# Altium project Peggy Receiver.PrjPcb
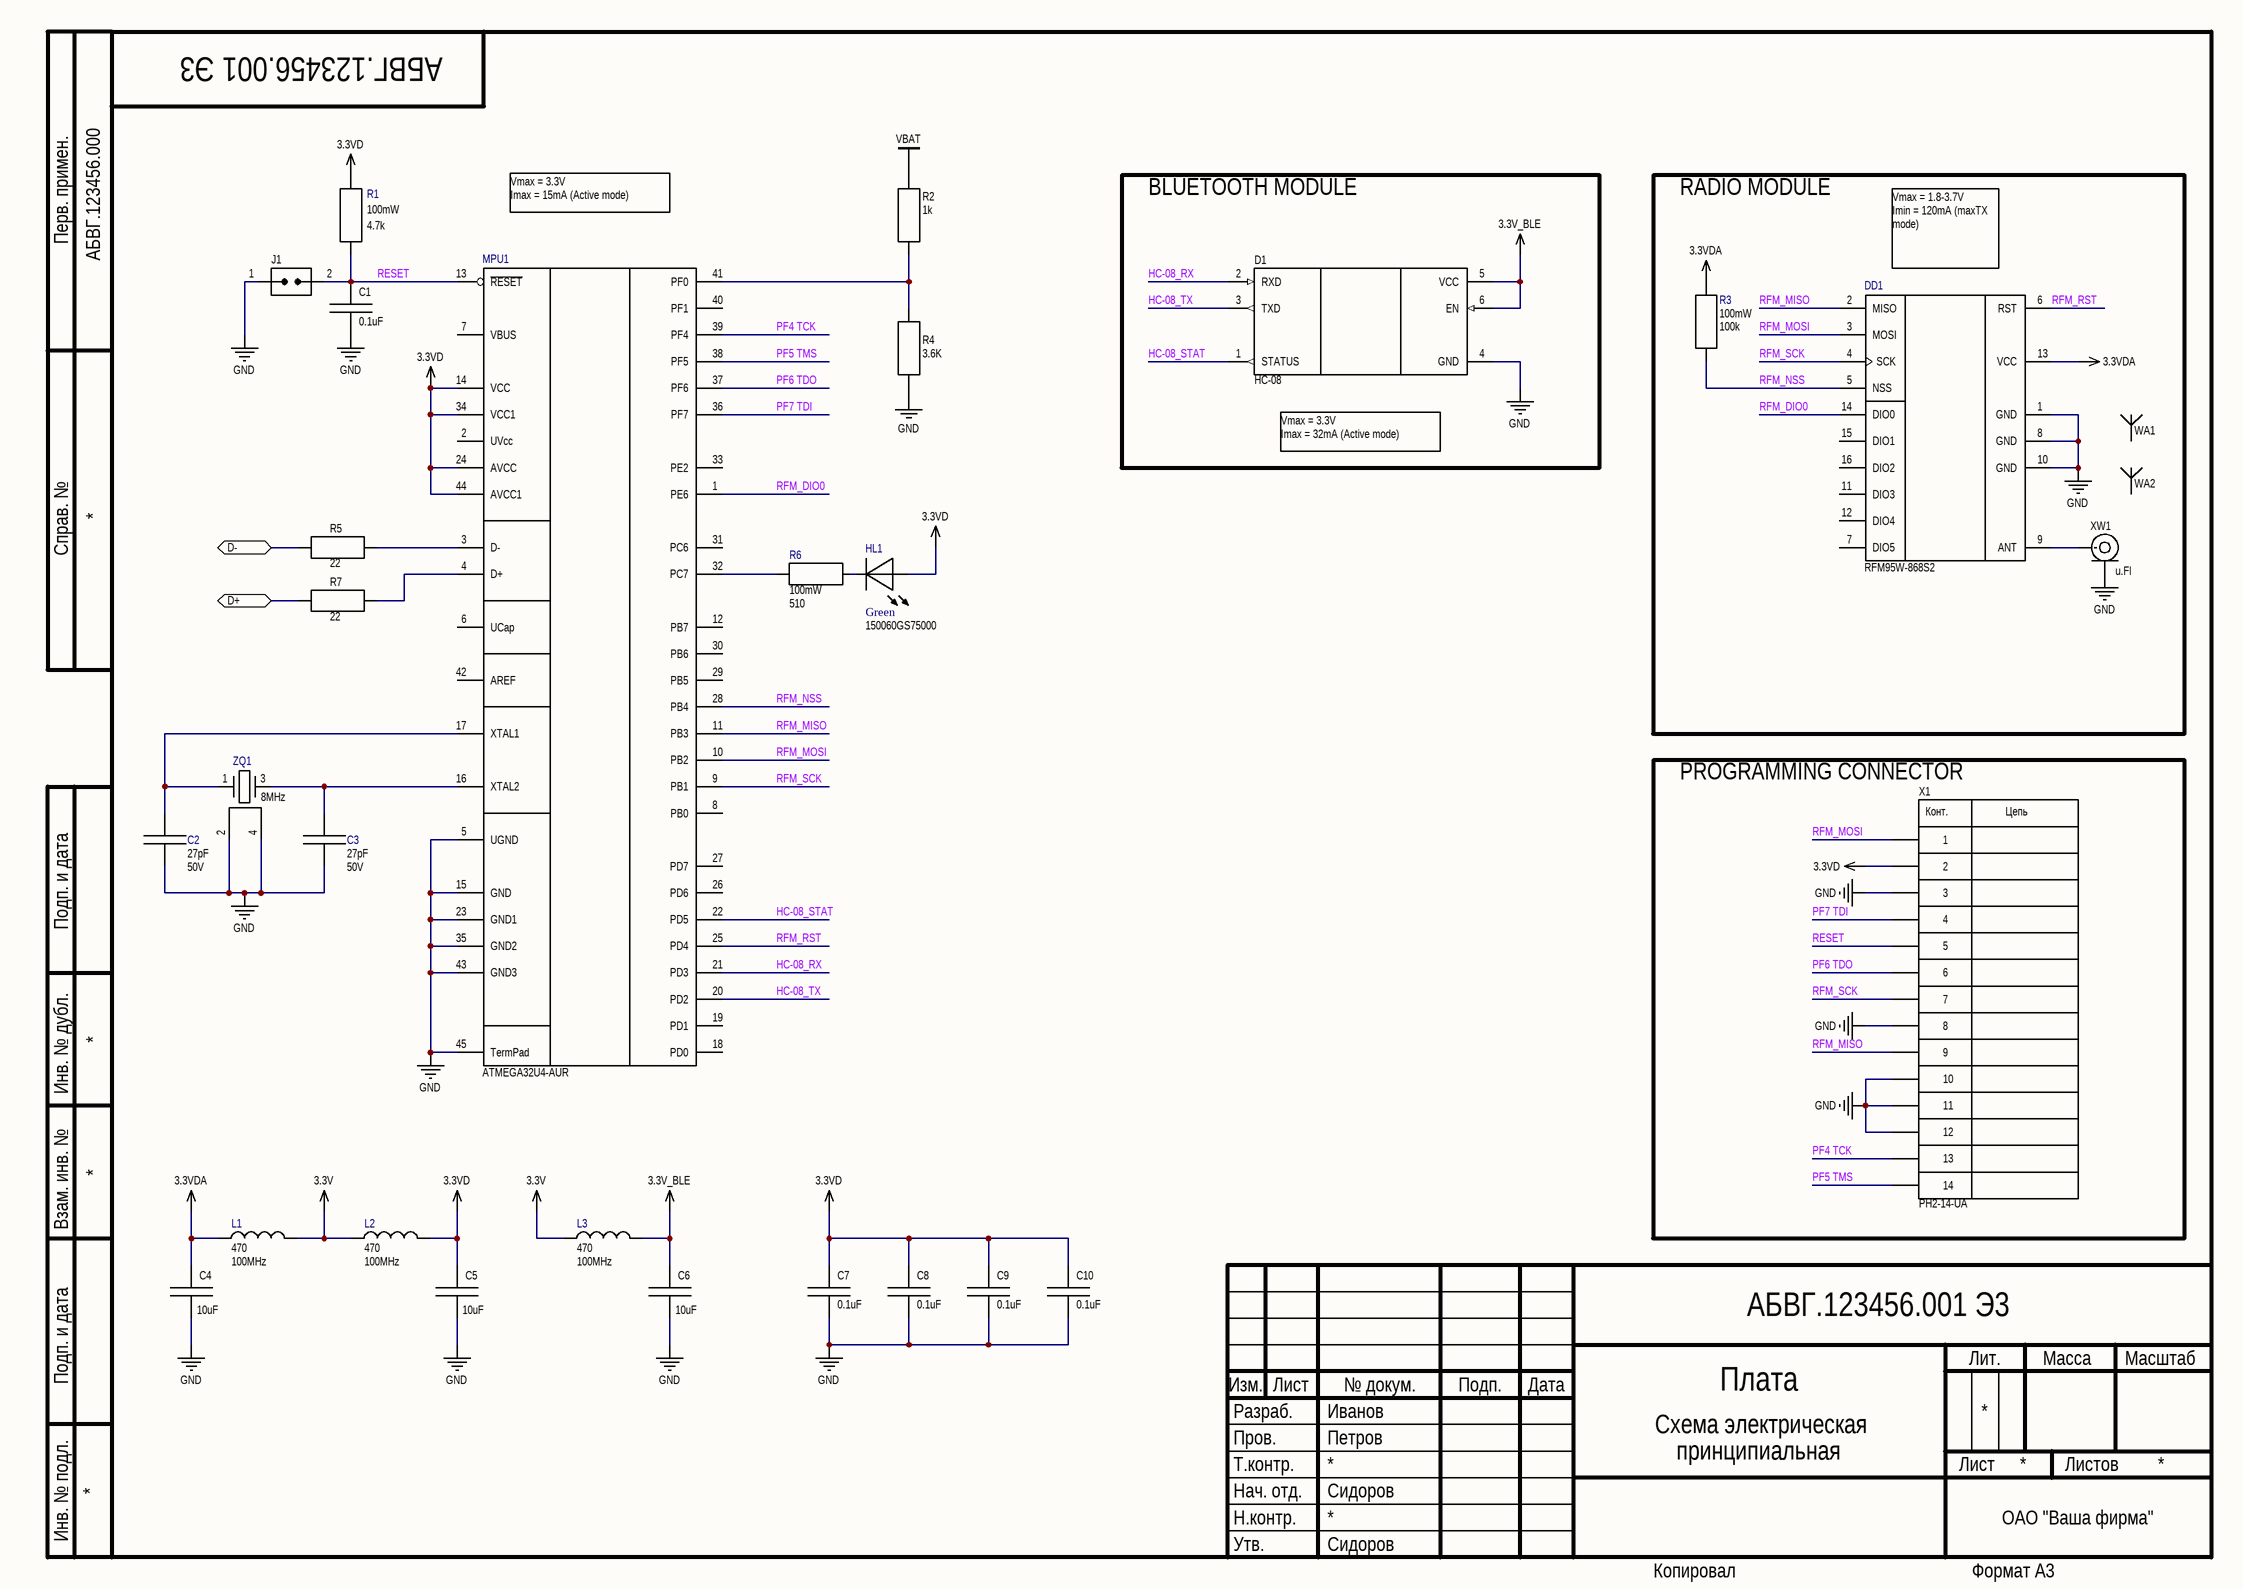
[diagram p0: Блок МК и радиомодуля Peggy Receiver.SchDoc]
2 sheets, 44 parts. Net scope: flat (ports and power ports of the same name join across sheets).
Board file: Печатная плата Peggy Receiver.PcbDoc
Sheets:
  Блок МК и радиомодуля Peggy Receiver.SchDoc
  Схема питания.SchDoc

## Sheet Блок МК и радиомодуля Peggy Receiver.SchDoc
size 420 x 297 mm; Address1: Address1; Address2: Address2; Address3: Address3; Address4: Address4; DocumentNumber: АБВГ.123456.001 Э3; SheetNumber: 1; Scale: 1:1; DocumentType: Схема электрическая принципиальная; FirstReferrence: АБВГ.123456.001; Обозначение документа: АБВГ.123456.001 Э3; Разраб.: Иванов; Пров.: Петров; Утв.: Сидоров; Наименование организации: ОАО "Ваша фирма"; Перв. применение: АБВГ.123456.000; Наименование изделия 1: Плата; Наименование изделия 2: Схема электрическая; Наименование изделия 3: принципиальная; Нач. отд.: Нач. отд.; Фамилия нач. отд.: Сидоров

### Parts
C1  0.1uF  [CH0603C]
C2  Capacitance: 27pF  Voltage Rating: 50V  [CAPC1608X87X35NL15T15]  (hidden comment: CC0603JPNPO9BN270)
C3  Capacitance: 27pF  Voltage Rating: 50V  [CAPC1608X87X35NL15T15]  (hidden comment: CC0603JPNPO9BN270)
C4  10uF  [CH1206C]
C5  10uF  [CH1206C]
C6  10uF  [CH1206C]
C7  0.1uF  [CH0603C]
C8  0.1uF  [CH0603C]
C9  0.1uF  [CH0603C]
C10  0.1uF  [CH0603C]
D1  HC-08  [MOD: SH-HC-08]
DD1  RFM95W-868S2  [RFM95W-868S2]
HL1  Color: Green  [CH0603LG]  (hidden comment: 150060GS75000)
J1  Jumper-2  [CON: JUMPER_2]  (value not drawn)
L1  Impedance: 470  Test Frequency: 100MHz  [MH2029-471Y-Footprint-1]  (hidden comment: MH2029-471Y)
L2  Impedance: 470  Test Frequency: 100MHz  [MH2029-471Y-Footprint-1]  (hidden comment: MH2029-471Y)
L3  Impedance: 470  Test Frequency: 100MHz  [MH2029-471Y-Footprint-1]  (hidden comment: MH2029-471Y)
MPU1  Manufacturer Part Number: ATMEGA32U4-AUR  [ATMEGA32U4-MU]  (hidden comment: ATMEGA32U4-AU)
R1  Power Rating: 100mW  Resistance: 4.7k  [CH0603R]  (hidden comment: RMCF0603FT4K70)
R2  1k  [CH0603R]
R3  value 100k  Power: 100mW  [RESC1608X55X25NL10T15]  (hidden comment: Resistor 100k +/-1% 0603 100 mW)
R4  3.6K  [CH0603R]
R5  22  [CH0603R]
R6  Power Rating: 100mW  Resistance: 510  [RESC1608X55X25NL10T15]  (hidden comment: RMCF0603JT510R)
R7  22  [CH0603R]
WA1  AEACAQ190012-S915  (value not drawn)
WA2  2111400100  (value not drawn)
X1  PH2-14-UA  [CON: PLD-14_SHIFTED]
XW1  u.Fl  [CON: u.Fl]
ZQ1  Frequency: 8MHz  [FY0800018-Footprint-1]  (hidden comment: FY0800018)

### Blocks framed on the sheet
BLUETOOTH MODULE: D1
RADIO MODULE: DD1 R3 WA1 WA2 XW1
PROGRAMMING CONNECTOR: X1

### Ports
D+ (bidir), D- (bidir)

### Nets
3.3V: L1.2 L2.1 L3.1
3.3V_BLE: C6.1 D1.5(VCC) D1.6(EN) L3.2
3.3VD: C5.1 C7.1 C8.1 C9.1 C10.1 HL1.2 L2.2 MPU1.14(VCC) MPU1.24(AVCC) MPU1.34(VCC1) MPU1.44(AVCC1) R1.2 X1.2
3.3VDA: C4.1 DD1.13(VCC) L1.1 R3.2
GND: C1.2 C2.1 C3.1 C4.2 C5.2 C6.2 C7.2 C8.2 C9.2 C10.2 D1.4(GND) DD1.1(GND) DD1.8(GND) DD1.10(GND) J1.1(IN) MPU1.5(UGND) MPU1.15(GND) MPU1.23(GND1) MPU1.35(GND2) MPU1.43(GND3) MPU1.45(TermPad) R4.1 X1.3 X1.8 X1.10 X1.11 X1.12 XW1.2(IN) ZQ1.2 ZQ1.4
VBAT: R2.2
HC-08_RX: D1.2(RXD) MPU1.21(PD3)
HC-08_STAT: D1.1(STATUS) MPU1.22(PD5)
HC-08_TX: D1.3(TXD) MPU1.20(PD2)
PF4 TCK: MPU1.39(PF4) X1.13
PF5 TMS: MPU1.38(PF5) X1.14
PF6 TDO: MPU1.37(PF6) X1.6
PF7 TDI: MPU1.36(PF7) X1.4
RESET: C1.1 J1.2(IN) MPU1.13(~{RESET}) R1.1 X1.5
RFM_DIO0: DD1.14(DIO0) MPU1.1(PE6)
RFM_MISO: DD1.2(MISO) MPU1.11(PB3) X1.9
RFM_MOSI: DD1.3(MOSI) MPU1.10(PB2) X1.1
RFM_NSS: DD1.5(NSS) MPU1.28(PB4) R3.1
RFM_RST: DD1.6(RST) MPU1.25(PD4)
RFM_SCK: DD1.4(SCK) MPU1.9(PB1) X1.7
NetC2_2: C2.2 MPU1.17(XTAL1) ZQ1.1
NetC3_2: C3.2 MPU1.16(XTAL2) ZQ1.3
NetDD1_9: DD1.9(ANT) XW1.1(IN)
NetHL1_1: HL1.1 R6.2
NetMPU1_3: MPU1.3(D-) R5.2
NetMPU1_4: MPU1.4(D+) R7.2
NetMPU1_32: MPU1.32(PC7) R6.1
NetMPU1_41: MPU1.41(PF0) R2.1 R4.2
NetR5_1: R5.1 ; port D-
NetR7_1: R7.1 ; port D+

Not connected (* = marked no-connect by the designer): DD1 7(DIO5) 11(DIO3) 12(DIO4) 15(DIO1) 16(DIO2); MPU1 2(UVcc) 6(UCap) 7(VBUS) 8(PB0) 12(PB7) 18(PD0) 19(PD1) 26(PD6) 27(PD7) 29(PB5) 30(PB6) 31(PC6) 33(PE2) 40(PF1) 42(AREF); WA1 1; WA2 1

### Notes on the sheet
- Vmax = 3.3V
  Imax = 15mA (Active mode)
- (near DD1) Vmax = 1.8-3.7V
  Imin = 120mA (maxTX mode)
- (near D1) Vmax = 3.3V
  Imax = 32mA (Active mode)
- Перв. примен.
- Справ. №
- Подп. и дата
- Инв. № дубл.
- Взам. инв. №
- Разраб.
- Изм.
- Лист
- № докум.
- Подп.
- Дата
- Лит.
- Масса
- Масштаб
- Пров.
- Т.контр.
- Листов
- Инв. № подл.
- Утв.
- Н.контр.
- Копировал
- Формат А3
- (in symbol 14-Connector) Конт.; Цепь

### Library data of the parts
C1 C7-C10 = Capacitor: Manufacturer: Murata Electronics; Model: GCM188R71H104KA57D; HelpURL: https://www.digikey.com/en/products/detail/murata-electronics/GCM188R71H104KA57D/1641653?s=N4IgTCBcDaIOIGECyBGAHGgSgdhQCRQAYAWAaQEEBWbAERAF0BfIA; ComponentKind: 0603 (1608 Metric); Value: 0.1uF; Supplier 1: Digi-Key; Supplier Part Number 1: 490-4779-1-ND
C2 C3 = CMP-009-00292-1: 0603 50V C0G 27pF 5% multilayer ceramic capacitor; Manufacturer: YAGEO; Length: 1.6mm; Package Quantity: 15000; Depth: 0.8mm; RoHS Compliant: Yes; Pins: 2; Case Code (Metric): 1608; Dielectric: C0G; Packaging: Tape and Reel; Series: NP0; Max Operating Temperature: 125°C; Case Code (Imperial): 0603; Case/Package: 0603; Tolerance: 5%; Termination: SMD/SMT; Min Operating Temperature: -55°C; Manufacturer Part Number: CC0603JPNPO9BN270
C4-C6 = Capacitor: CAP CER 10UF 16V X7R 1206; Manufacturer: Murata Electronics; Model: GCM31CR71C106KA64K; HelpURL: https://www.digikey.com/en/products/detail/murata-electronics/GCM31CR71C106KA64K/2592432?s=N4IgTCBcDaIOIGECyBmAjAgSgdg2gDAGwDSAgoQCzEgC6AvkA; ComponentKind: 1206 (3216 Metric); Value: 10uF; Supplier 1: Digi-Key; Supplier Part Number 1: 490-14746-1-ND
D1 = HC-08: Bluetooth 4.0 module; Manufacturer: China; Model: HC-08; ComponentKind: Bluetooth 2.4GHz
DD1 = CMP-032-0024-3: RF TXRX MODULE ISM<1GHZ; Manufacturer: RF Solutions; Data Rate: 300Kbps; Sensitivity: -123dBm; Current - Receiving: 12.1mA; Interface: SPI; Current - Transmitting: 120mA; Frequency: 868MHz; Max Operating Temperature: 70°C; Case/Package: SMD/SMT; Mount: Surface Mount; Packaging: Bulk; Min Operating Temperature: -20°C; Manufacturer Part Number: RFM95W-868S2
HL1 = CMP-007-00037-1: WURTH ELEKTRONIK - 150060GS75000 - LED, Green, 520 nm, 3.2 V, 30 mA, 430 mcd RoHS Compliant: Yes; Manufacturer: Würth Elektronik; Dominant Wavelength: 520nm; Forward Current: 30mA; Forward Voltage: 3.2V; Test Current: 20mA; Viewing Angle: 140°; Lens Style: Clear,Rectangular; Luminous Intensity: 430mcd; RoHS Compliant: Yes; Manufacturer Part Number: 150060GS75000; Wavelength: 520nm; Width: 0.8mm; Mount: Surface Mount; REACH SVHC: Unknown; Package Quantity: 4000; Max Operating Temperature: 85°C; Colour: Green; Length: 1.6mm; Case Code (Metric): 1608; Height: 0.7mm; Lead Free: Lead Free; Min Operating Temperature: -40°C; Case Code (Imperial): 0603; Packaging: Tape and Reel; Case/Package: 0603
J1 = Jumper-2: Jumper; Manufacturer: China; Model: PLS-2
L1-L3 = CMP-006-00041-1: Ferrite Beads High Current Chip 470Ohm 25% 100MHz 1A 0.2Ohm DCR 0805 T/R; Manufacturer: Bourns Inc.; DC Resistance (DCR): 200mR; Number of Lines: 1; Case Code (Metric): 2012; Max Operating Temperature: 125°C; Package Quantity: 4000; Packaging: Tape and Reel; Min Operating Temperature: -55°C; Case/Package: 0805; Core Material: Ferrite; Height: 0.043inch; Tolerance: 25%; Max Current Rating: 1A; RoHS Compliant: Yes; Case Code (Imperial): 0805; Termination: SMD/SMT; Depth: 1.4mm; Series: MH; Width: 1.2mm; Manufacturer Part Number: MH2029-471Y; Mount: Surface Mount; Length: 0.079inch; Max DC Current: 1A
MPU1 = CMP-020-00016-10: 8-bit Microcontroller with 32 Kbytes of ISP Flash and USB Controller, 2.7 to 5.5 V, -40 to 85 degC, 44-Pin QFP, Tray; Manufacturer: Atmel; PWM Channels: 8; Density: 32KB; Max Supply Voltage: 5.5V; Min Supply Voltage: 2.7V; Ethernet Channels: 0; Max Clock Frequency: 16MHz; ADC Channels: 12; I/Os: 26; RAM Size: 2.5KB; Package Version: Rev. J, 02/2014; Interface: USART; Case/Package: TQFP; Package Reference: 44ML; RoHS Compliant: True; Packaging: Tray; Mounting Technology: SM; Package Quantity: 800; Max Operating Temperature: 85°C; Datasheet Version: Rev. 7766IS, 07/2015; Package URL: http://www.atmel.com/images/atmel-7766-8-bit-avr-atmega16u4-32u4_summary.pdf; Min Operating Temperature: -40°C; Datasheet URL: http://www.atmel.com/images/atmel-7766-8-bit-avr-atmega16u4-32u4_summary.pdf; Manufacturer URL: http://www.atmel.com/; Package Description: 44-Pin Thin Profile Plastic Quad Flat Papckage, Body 10 x 10 mm, Pitch 0.8 mm; Frequency: 16MHz; Pins: 44
R1 = CMP-009-00269-2: Res Thick Film 0603 4.7K Ohm 1% 1/10W 100ppm/C Molded SMD SMD Paper T/R; Manufacturer: Stackpole Electronics Inc; Temperature Coefficient: 100ppm/°C; Component Comment: 4.7k 100mW; Military Standard: Not; Resistor Type: Thick Film; Tolerance: 1%; Contact Plating: Tin,Matte; Max Power Dissipation: 100mW; Case/Package: 0603; Length: 1.55mm; Case Code (Imperial): 0603; Max Operating Temperature: 155°C; Depth: 0.8mm; Manufacturer Part Number: RMCF0603FT4K70; Series: RMCF; Radiation Hardening: No; Case Code (Metric): 1608; Min Operating Temperature: -55°C; Lead Free: Lead Free; Width: 0.031inch; Height: 0.022inch; Number of Terminations: 2; Features: Automotive AEC-Q200; Construction: Rectangular; Packaging: Tape and Reel; RoHS Compliant: Yes; Mount: Surface Mount
R2 = Resistor: Manufacturer: YAGEO; Model: RC0603FR-071KL; HelpURL: https://www.digikey.com/en/products/detail/yageo/RC0603FR-071KL/726843; ComponentKind: 0603 (1608 Metric); Value: 1k; Supplier 1: Digi-Key; Supplier Part Number 1: 311-1.00KHRCT-ND
R3 = CMP-009-00023-7: Chip Resistor, 100 KOhm, +/- 1%, 0.1 W, -55 to 155 degC, 0603 (1608 Metric); Voltage Rating: 50V; Pins: 2; Case/Package: 0603; RoHS Compliant: True; Min Operating Temperature: -55°C; Max Operating Temperature: 155°C; Tolerance: 1%; Mounting Technology: SM
R4 = Resistor: RES 3.6K OHM 1% 1/10W 0603; Manufacturer: YAGEO; Model: RC0603FR-073K6L; HelpURL: https://www.digikey.com/en/products/detail/yageo/RC0603FR-073K6L/727132; ComponentKind: 0603 (1608 Metric); Value: 3.6K; Supplier 1: Digi-Key; Supplier Part Number 1: 311-3.60KHRCT-ND
R5 R7 = Resistor: RES 22 OHM 1% 1/10W 0603; Manufacturer: YAGEO; Model: RC0603FR-0722RL; HelpURL: https://www.digikey.com/en/products/detail/yageo/RC0603FR-0722RL/727055; ComponentKind: https://www.digikey.com/en/products/detail/yageo/RC0603FR-0722RL/727055; Value: 22; Supplier 1: Digi-Key; Supplier Part Number 1: 311-22.0HRCT-ND
R6 = CMP-00079-1: 510 Ohms ±5% 0.1W, 1/10W Chip Resistor 0603 (1608 Metric) Automotive AEC-Q200 Thick Film; Manufacturer: Stackpole Electronics Inc; Temperature Coefficient: 200ppm/°C; Case Code (Metric): 1608; Packaging: Tape and Reel; Max Power Dissipation: 100mW; Resistor Type: Thick Film; Military Standard: Not; Features: Automotive AEC-Q200; Lead Free: Lead Free; Case/Package: 0603; Case Code (Imperial): 0603; Max Operating Temperature: 155°C; Construction: Rectangular; Number of Terminations: 2; Contact Plating: Tin,Matte; Radiation Hardening: No; Series: RMCF; Width: 0.031inch; Manufacturer Part Number: RMCF0603JT510R; Size Code: 0603; Depth: 0.8mm; Mount: Surface Mount; Height: 0.022inch; Tolerance: 5%; Length: 0.061inch; Min Operating Temperature: -55°C; RoHS Compliant: Yes
WA1 = Antenna 1pin: 1.583GHz GPS Ceramic Patch RF Antenna 1.559GHz ~ 1.610GHz 17dBi - -; Manufacturer: Abracon LLC; Model: AEACAQ190012-S915; HelpURL: https://www.digikey.com/en/products/detail/abracon-llc/AEACAQ190012-S915/8593253; ComponentKind: *; Supplier 1: Digi-Key; Supplier Part Number 1: 535-14498-ND
WA2 = Antenna 1pin: 1.583GHz GPS Ceramic Patch RF Antenna 1.559GHz ~ 1.610GHz 17dBi - -; Manufacturer: Molex; Model: 2111400100; HelpURL: https://www.digikey.com/en/products/detail/molex/2111400100/9953925; ComponentKind: *; Supplier 1: Digi-Key; Supplier Part Number 1: WM25681-ND
X1 = 14-Connector: Manufacturer: Adam Tech; Model: PH2-14-UA; HelpURL: https://www.digikey.com/en/products/detail/adam-tech/PH2-14-UA/9830507; ComponentKind: Connector Header Through Hole 14 position; Supplier 1: Digi-Key; Supplier Part Number 1: 2057-PH2-14-UA-ND
XW1 = u.Fl: RF; Manufacturer: Hirose Electric Co Ltd; Model: CONUFL001-SMD-T; HelpURL: https://www.digikey.com/en/products/detail/linx-technologies-inc/CONUFL001-SMD-T/7427732?s=N4IgTCBcDaIMIHkByBVAYgGQAxYIwFoBlAWQBF8AVEAXQF8g; ComponentKind: Surface Mount Solder; Supplier 1: Digi-Key; Supplier Part Number 1: CONUFL001-SMD-TCT-ND
ZQ1 = CMP-003-00033-4: Crystal 8MHz ±30ppm (Tol) ±30ppm (Stability) 18pF FUND 100Ohm 4-Pin SMD T/R; Manufacturer: Diodes Incorporated; ESR (Equivalent Series Resistance): 100R; Manufacturer Part Number: FY0800018; Frequency Stability: 30ppm; Frequency Tolerance: 30ppm; Load Capacitance: 18pF; Packaging: Cut Tape; Mount: Surface Mount; Max Operating Temperature: 85°C; Min Operating Temperature: -40°C; Height: 0.043inch; Case/Package: SMD/SMT; Width: 0.126inch; Length: 0.197inch

## Sheet Схема питания.SchDoc
size 209 x 297 mm; Address1: Address1; Address2: Address2; Address3: Address3; Address4: Address4; DocumentNumber: АБВГ.123456.001 Э3; SheetNumber: 1; Scale: 1:1; DocumentType: Схема электрическая принципиальная; FirstReferrence: АБВГ.123456.001; Обозначение документа: АБВГ.123456.001 Э3
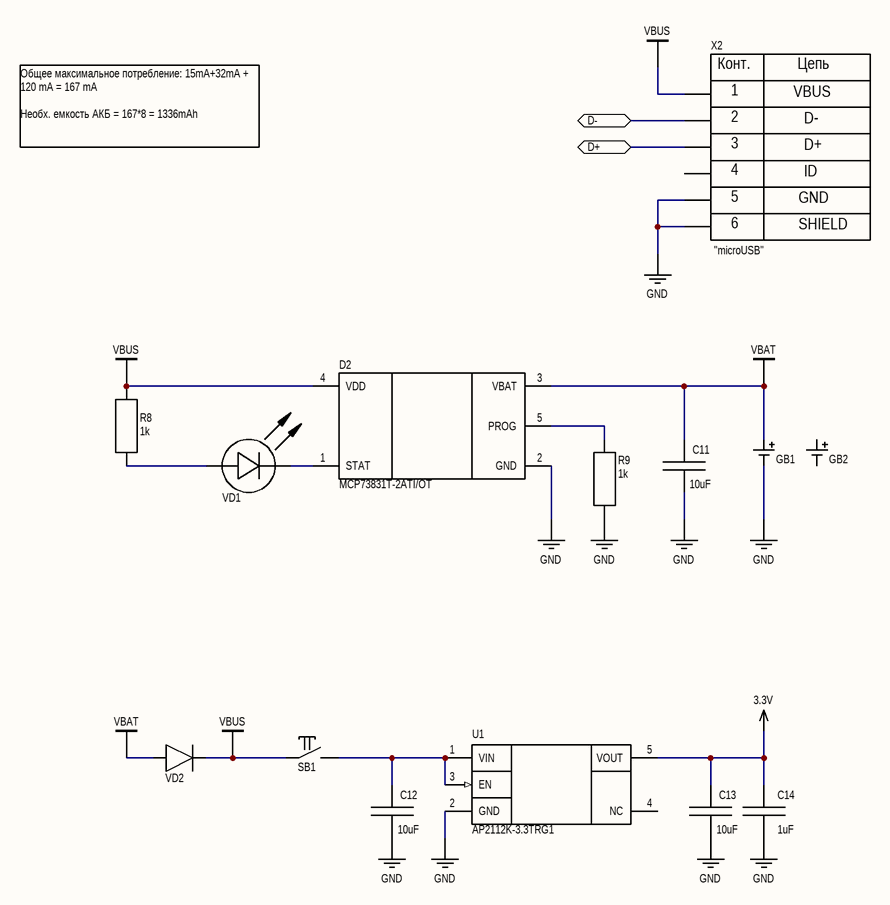
[diagram p1: Схема питания.SchDoc]

### Parts
C11  10uF  [CH1206C]
C12  10uF  [CH1206C]
C13  10uF  [CH1206C]
C14  1uF  [CH0603C]
D2  MCP73831T-2ATI/OT  [SOT23-5]
GB1  1-12 шт., перезаряжаемые литий-полимерные аккумуляторы 3,7 в, 1260100 мАч  [BAT: 34.5X52MM (only pads)]  (value not drawn)
GB2  LP103450JH+PCM+PTC+2 WIRES 70MM  [BAT: 34.5X52MM]  (value not drawn)
R8  1k  [CH0603R]
R9  1k  [CH0603R]
SB1  "Кнопка"  [BUT: 2PADS 2x2mm]  (value not drawn)
U1  AP2112K-3.3TRG1  [SOT-25]
VD1  *  [CH0603LR]  (value not drawn)
VD2  BAT54XV2T1G  [SOD523]  (value not drawn)
X2  "microUSB"  [CON: MicroUSB - TH]

### Ports
D+ (bidir), D- (bidir)

### Nets
3.3V: C13.1 C14.1 U1.5(VOUT)
GND: C11.2 C12.2 C13.2 C14.2 D2.2(GND) GB1.2(-) R9.1 U1.2(GND) X2.5 X2.6
VBAT: C11.1 D2.3(VBAT) GB1.1(+) VD2.1
VBUS: D2.4(VDD) R8.2 SB1.1 VD2.2 X2.1
NetC12_1: C12.1 SB1.2 U1.1(VIN) U1.3(EN)
NetD2_1: D2.1(STAT) VD1.2(C)
NetD2_5: D2.5(PROG) R9.2
NetR5_1: X2.2 ; port D-
NetR7_1: X2.3 ; port D+
NetR8_1: R8.1 VD1.1(A)

Not connected (* = marked no-connect by the designer): GB2 1(+) 2(-); U1 4(NC); X2 4

### Notes on the sheet
- Общее максимальное потребление: 15mA+32mA + 120 mA = 167 mA
  Необх. емкость АКБ = 167*8 = 1336mAh
- Подп. и дата
- Инв. № дубл.
- Взам. инв. №
- Инв. № подл.
- Изм.
- Лист
- № докум.
- Подп.
- Дата
- Копировал
- Формат А4
- (in symbol USB - micro AB) Конт.; Цепь; VBUS; D-; D+; ID; GND; SHIELD

### Library data of the parts
C11-C13 = Capacitor: as C4 on sheet Блок МК и радиомодуля Peggy Receiver; HelpURL: https://www.digikey.com/en/products/detail/murata-electronics/GCM31CR71C106KA64K/2592432?s=N4IgTCBcDaIOIGECyBmAjAgSgdg2gDAGwDSAgoQCzEgC6AvkA; ComponentKind: 1206 (3216 Metric); Value: 10uF; Supplier 1: Digi-Key; Supplier Part Number 1: 490-14746-1-ND
C14 = Capacitor: Manufacturer: Samsung Electro-Mechanics; Model: CL10B105KP8NNNC; HelpURL: https://www.digikey.com/en/products/detail/samsung-electro-mechanics/CL10B105KP8NNNC/3887604; ComponentKind: 0603 (1608 Metric); Value: 1uF; Supplier 1: Digi-Key; Supplier Part Number 1: 1276-1946-1-ND
D2 = MCP73831T-2ATI/OT: Li-ion chargers; Manufacturer: Microchip Technology; Model: MCP73831T-2ATI/OT; ComponentKind: SOT23-5; HelpURL: https://www.digikey.com/en/products/detail/microchip-technology/MCP73831T-2ATI-OT/964303; Supplier 1: Digi-Key; Supplier Part Number 1: MCP73831T-2ATI/OTCT-ND
GB1 = Battery_1CELL: Manufacturer: AliExpress; Model: 1-12 шт., перезаряжаемые литий-полимерные аккумуляторы 3,7 в, 1260100 мАч; HelpURL: https://aliexpress.ru/item/1005002756145305.html?srcSns=sns_More&businessType=ProductDetail&spreadType=socialShare&tt=MG&sku_id=12000021992697124; ComponentKind: smd
GB2 = LP103450JH+PCM+PTC+2 WIRES 70MM: LiPo Battery; Manufacturer: Jauch Quartz; Model: LP103450JH+PCM+PTC+2 WIRES 70MM; HelpURL: https://www.digikey.com/en/products/detail/jauch-quartz/LP103450JH-PCM-PTC-2-WIRES-70MM/9560994; ComponentKind: *; Supplier 1: Digi-Key; Supplier Part Number 1: 1908-LP103450JH+PCM+PTC+2WIRES70MM-ND
R8 R9 = Resistor: as R2 on sheet Блок МК и радиомодуля Peggy Receiver; HelpURL: https://www.digikey.com/en/products/detail/yageo/RC0603FR-071KL/726843; ComponentKind: 0603 (1608 Metric); Value: 1k; Supplier 1: Digi-Key; Supplier Part Number 1: 311-1.00KHRCT-ND
SB1 = Tactile switches: Manufacturer: CW Industries; Model: GRB112B802BR1; HelpURL: https://www.digikey.com/en/products/detail/cw-industries/GRB112B802BR1/2349683; ComponentKind: https://www.digikey.com/en/products/detail/cw-industries/GRB112B802BR1/2349683; Supplier 1: Digi-Key; Supplier Part Number 1: CW103-ND
U1 = AP2112K-3.3TRG1: IC REG LINEAR 3.3V 600MA SOT25; Manufacturer: Diodes Incorporated; Model: AP2112K-3.3TRG1; HelpURL: https://www.digikey.com/en/products/detail/diodes-incorporated/AP2112K-3-3TRG1/4470746; ComponentKind: SOT-25; ComponentLink1Description: HelpURL; ComponentLink1URL: https://www.digikey.com/en/products/detail/diodes-incorporated/AP61100Z6-7/11696569; Supplier 1: Digi-Key; Supplier Part Number 1: AP2112K-3.3TRG1DICT-ND
VD1 = LED: Manufacturer: Lite-On Inc.; Model: LTST-C191KRKT; HelpURL: https://www.digikey.com/en/products/detail/liteon/LTST-C191KRKT/386837; ComponentKind: 0603 (1608 Metric); Value: *; Supplier 1: Digi-Key; Supplier Part Number 1: 160-1447-1-ND
VD2 = Diod: Manufacturer: onsemi; ComponentKind: SOD-523; Model: BAT54XV2T1G; HelpURL: https://www.digikey.com/en/products/detail/onsemi/BAT54XV2T1G/918321; Supplier 1: Digi-Key; Supplier Part Number 1: BAT54XV2T1GOSCT-ND
X2 = USB - micro AB: USB; Manufacturer: Molex; Model: 1050170001; HelpURL: https://www.digikey.com/en/products/detail/molex/1050170001/2350832?s=N4IgTCBcDaIDoBcCMAGArCpB2AtC-SIAugL5A; Supplier 1: Digi-Key; Supplier Part Number 1: WM1399CT-ND

## Nets that join several sheets
3.3V: Блок МК и радиомодуля Peggy Receiver (L1.2 L2.1 L3.1), Схема питания (C13.1 C14.1 U1.5)
GND: Блок МК и радиомодуля Peggy Receiver (30 pins), Схема питания (10 pins)
VBAT: Блок МК и радиомодуля Peggy Receiver (R2.2), Схема питания (C11.1 D2.3 GB1.1 VD2.1)
NetR5_1: Блок МК и радиомодуля Peggy Receiver (R5.1), Схема питания (X2.2)
NetR7_1: Блок МК и радиомодуля Peggy Receiver (R7.1), Схема питания (X2.3)